# Altium schematic sheet STM32F301C8.SchDoc: STM32F301C7
size A4; Revision: 1.0
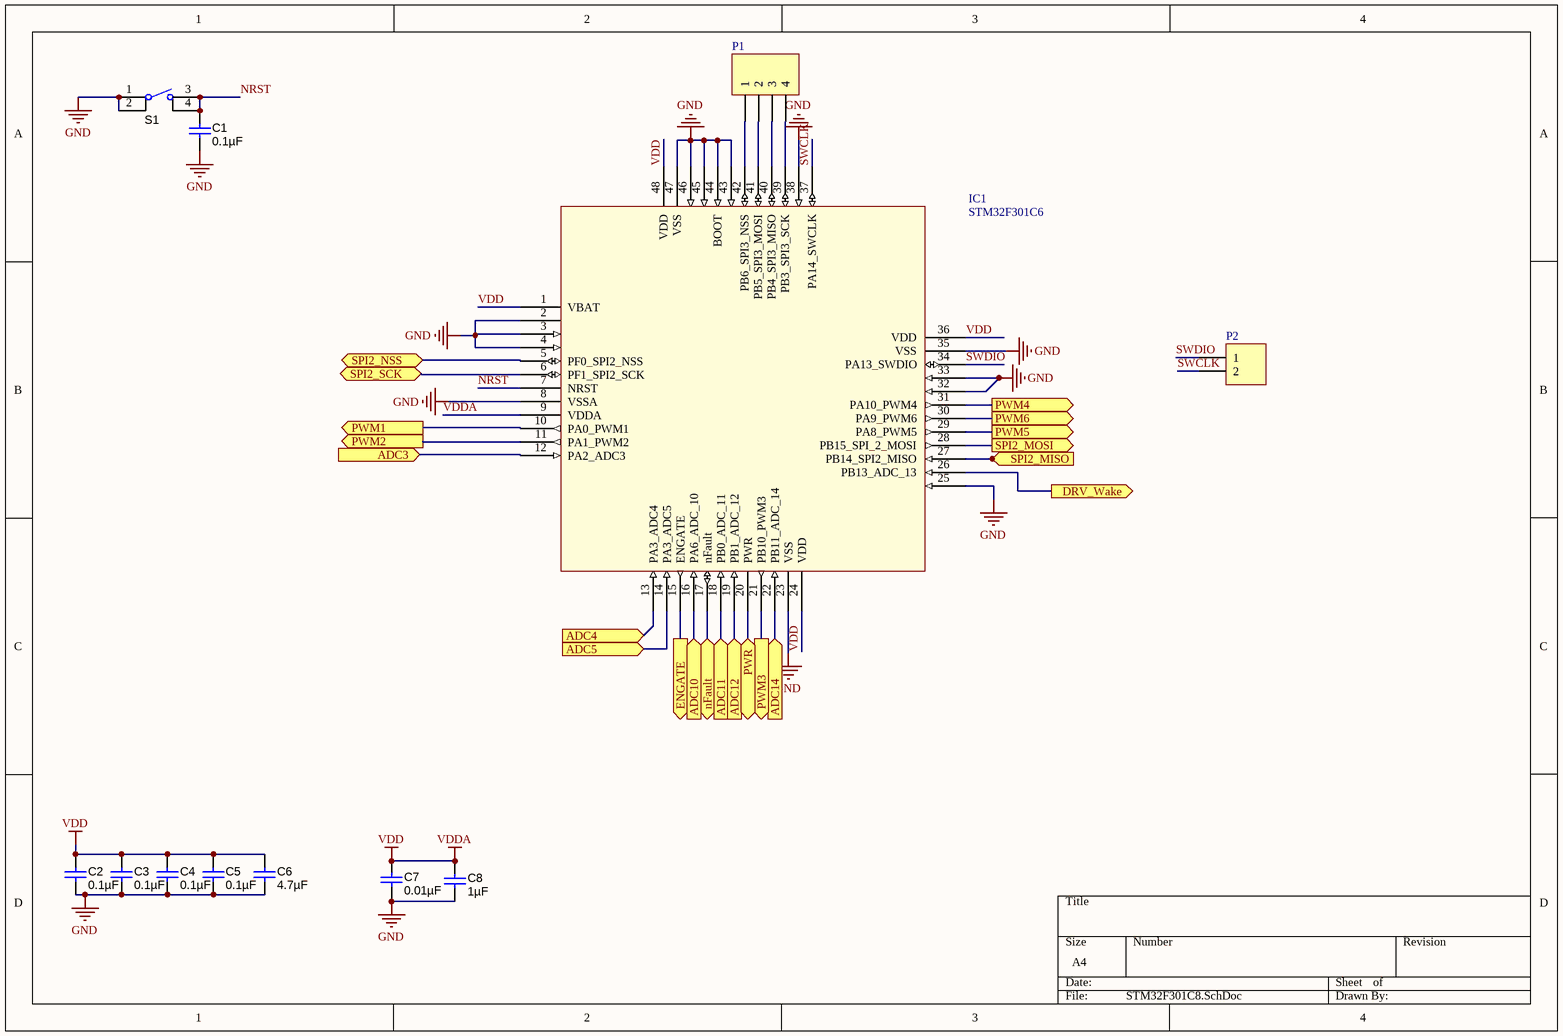
[diagram p0: STM32F301C8.SchDoc]

## Parts
C1  ValueDisplayed: 0.1µF  [0603L]  (hidden comment: C1608X7R1H104K)
C2  ValueDisplayed: 0.1µF  [0603L]  (hidden comment: C1608X7R1H104K)
C3  ValueDisplayed: 0.1µF  [0603L]  (hidden comment: C1608X7R1H104K)
C4  ValueDisplayed: 0.1µF  [0603L]  (hidden comment: C1608X7R1H104K)
C5  ValueDisplayed: 0.1µF  [0603L]  (hidden comment: C1608X7R1H104K)
C6  ValueDisplayed: 4.7µF  [0805L]  (hidden comment: GRM21BR71A475KA73L)
C7  ValueDisplayed: 0.01µF  [0603L]  (hidden comment: C1608X8R1H103K)
C8  ValueDisplayed: 1µF  [0603L]  (hidden comment: C1608X7R1C105K)
IC1  STM32F301C6  [LQFP48-7x7mm]
P1  (no value)  [HDR1X4]
P2  (no value)  [HDR1X2]
S1  4-1437565-1  [SW_FSM4JSMA]  (value not drawn)

## Ports
ADC3 (in), ADC4 (in), ADC5 (in), ADC10 (in), ADC11 (in), ADC12 (in), ADC14 (in), DRV_Wake (out), ENGATE (out), nFault (bidir), PWM1 (out), PWM2 (out), PWM3 (out), PWM4 (out), PWM5 (out), PWM6 (out), PWR, SPI2_MISO (in), SPI2_MOSI (out), SPI2_NSS (bidir), SPI2_SCK (bidir)

## Nets
GND: C1.2 C2.2 C3.2 C4.2 C5.2 C6.2 C7.2 C8.2 IC1.2 IC1.3 IC1.4 IC1.8(VSSA) IC1.23(VSS) IC1.25 IC1.32 IC1.33 IC1.35(VSS) IC1.38 IC1.43 IC1.44(BOOT) IC1.45 IC1.46 IC1.47(VSS) S1.1 S1.2
VDD: C2.1 C3.1 C4.1 C5.1 C6.1 C7.1 C8.1 IC1.1(VBAT) IC1.9(VDDA) IC1.24(VDD) IC1.36(VDD) IC1.48(VDD)  [also labelled VDDA]
ADC3: IC1.12(PA2_ADC3) ; port ADC3
ADC4: IC1.13(PA3_ADC4) ; port ADC4
ADC5: IC1.14(PA3_ADC5) ; port ADC5
ADC10: IC1.16(PA6_ADC_10) ; port ADC10
ADC11: IC1.18(PB0_ADC_11) ; port ADC11
ADC12: IC1.19(PB1_ADC_12) ; port ADC12
ADC14: IC1.22(PB11_ADC_14) ; port ADC14
DRV_Wake: IC1.26(PB13_ADC_13) ; port DRV_Wake
ENGATE: IC1.15(ENGATE) ; port ENGATE
nFault: IC1.17(nFault) ; port nFault
NRST: C1.1 IC1.7(NRST) S1.3 S1.4
PWM1: IC1.10(PA0_PWM1) ; port PWM1
PWM2: IC1.11(PA1_PWM2) ; port PWM2
PWM3: IC1.21(PB10_PWM3) ; port PWM3
PWM4: IC1.31(PA10_PWM4) ; port PWM4
PWM5: IC1.29(PA8_PWM5) ; port PWM5
PWM6: IC1.30(PA9_PWM6) ; port PWM6
PWR: IC1.20(PWR) ; port PWR
SPI2_MISO: IC1.27(PB14_SPI2_MISO) ; port SPI2_MISO
SPI2_MOSI: IC1.28(PB15_SPI_2_MOSI) ; port SPI2_MOSI
SPI2_NSS: IC1.5(PF0_SPI2_NSS) ; port SPI2_NSS
SPI2_SCK: IC1.6(PF1_SPI2_SCK) ; port SPI2_SCK
SWCLK: IC1.37(PA14_SWCLK) P2.2
SWDIO: IC1.34(PA13_SWDIO) P2.1
NetIC1_39: IC1.39(PB3_SPI3_SCK) P1.4
NetIC1_40: IC1.40(PB4_SPI3_MISO) P1.3
NetIC1_41: IC1.41(PB5_SPI3_MOSI) P1.2
NetIC1_42: IC1.42(PB6_SPI3_NSS) P1.1

## Library data of the parts
C1-C5 = C1608X7R1H104K: CAP, CERM, 0.1 µF, 50 V, +/- 10%, X7R, 0603; Manufacturer: TDK; Polarized: N; CompType: Capacitor; Value: 0.1uF; U/M: EA; Cap_F: 0.0000001; Tolerance_%: 10; ESR_ohm: 0.017; Value1: 0.017 ohm; VDC_V: 50; Value2: 50V; TaMin_C: -55; TaMax_C: 125; Cap_Case: 0603; AEC Category: Q200; SymbolVersion: 2008-07-09; PartNumber: C1608X7R1H104K; PackageReference: 0603; RoHS: Y; MountType: SMT; Technology: Ceramic; TempCo: X7R; Published: 2008-06-19; Publisher: Texas Instruments; LatestRevisionDate: 2015-12-04; ComponentLink1Description: Datasheet link; ComponentLink1URL: http://www.tdk.co.jp/tefe02/e412_c.pdf; Supplier 1: Digi-Key; Supplier Part Number 1: 445-1314-1-ND; Supplier 2: Farnell; Supplier Part Number 2: 1118182; AEC Qualified: ?
C6 = GRM21BR71A475KA73L: CAP, CERM, 4.7 µF, 10 V, +/- 10%, X7R, 0805; Manufacturer: MuRata; Polarized: N; CompType: Capacitor; Value: 4.7uF; U/M: EA; Cap_F: 0.0000047; Tolerance_%: 10; Value1: Unknown; Value2: 10V; TaMin_C: -55; TaMax_C: 125; Cap_Case: 0805; AEC Category: Q200; SymbolVersion: 2008-07-09; PartNumber: GRM21BR71A475KA73L; PackageReference: 0805; RoHS: Y; VDC_V: 10; MountType: SMT; Technology: Ceramic; TempCo: X7R; Published: 2008-06-19; Publisher: Texas Instruments; LatestRevisionDate: 2015-12-04; ComponentLink1Description: Datasheet link; ComponentLink1URL: http://search.murata.co.jp/Ceramy/PnsearchViewAction.do?HnOFG=ON&HnNFG=ON&SEL_CNT=50&sLang=en&sKey=GRM21BR71A475KA73L&x=9&y=9&search=startwith; Supplier 1: Digi-Key; Supplier Part Number 1: GRM21BR71A475KA73L-ND; Supplier 2: Mouser; Supplier Part Number 2: 81-GRM21BR71A475KA73; Supplier 3: Farnell; Supplier Part Number 3: 1845769; AEC Qualified: ?
C7 = C1608X8R1H103K: CAP, CERM, 0.01 µF, 50 V, +/- 10%, X8R, 0603; Manufacturer: TDK; Polarized: N; CompType: Capacitor; Value: 0.01uF; U/M: EA; Cap_F: 0.00000001; Tolerance_%: 10; ESR_ohm: 0.051; Value1: 0.051 ohm; VDC_V: 50; Value2: 50V; TaMin_C: -55; TaMax_C: 150; Cap_Case: 0603; AEC Category: Q200; SymbolVersion: 2008-07-09; PartNumber: C1608X8R1H103K; PackageReference: 0603; RoHS: Y; MountType: SMT; Technology: Ceramic; TempCo: X8R; Published: 2008-06-19; Publisher: Texas Instruments; LatestRevisionDate: 2015-12-04; ComponentLink1Description: Datasheet link; ComponentLink1URL: http://www.tdk.com/pdf/X8R.pdf; Supplier 1: Digi-Key; Supplier Part Number 1: 445-2504-1-ND; Supplier 2: Farnell; Supplier Part Number 2: 1844454; AEC Qualified: ?
C8 = C1608X7R1C105K: CAP, CERM, 1 µF, 16 V, +/- 10%, X7R, 0603; Manufacturer: TDK; Polarized: N; CompType: Capacitor; Value: 1uF; U/M: EA; Cap_F: 0.000001; Tolerance_%: 10; ESR_ohm: 0.0057; Value1: 0.0057 ohm; VDC_V: 16; Value2: 16V; TaMin_C: -55; TaMax_C: 125; Cap_Case: 0603; AEC Category: Q200; SymbolVersion: 2008-07-09; PartNumber: C1608X7R1C105K; PackageReference: 0603; RoHS: Y; MountType: SMT; Technology: Ceramic; TempCo: X7R; Published: 2008-06-19; Publisher: Texas Instruments; LatestRevisionDate: 2015-12-04; ComponentLink1Description: Datasheet link; ComponentLink1URL: http://www.tdk.co.jp/tefe02/e412_c.pdf; Supplier 1: Digi-Key; Supplier Part Number 1: 445-1604-1-ND; Supplier 2: Farnell; Supplier Part Number 2: 1907343; AEC Qualified: ?
P1 = Header 4: Header, 4-Pin; LatestRevisionDate: 17-Jul-2002; LatestRevisionNote: Re-released for DXP Platform.; Publisher: Altium Limited
P2 = Header 2: Header, 2-Pin; LatestRevisionDate: 17-Jul-2002; LatestRevisionNote: Re-released for DXP Platform.; Publisher: Altium Limited
S1 = 4-1437565-1: Switch, Tactile, SPST-NO, 0.05A, 12V, SMT; Manufacturer: TE Connectivity; SymbolCreator: a0412235; VDC_V: 12; SwitchFunction: Off-Mom; PositionCount: 1; CurrentRating_mA: 50; SymbolVersion: 2013-06-27; PartNumber: 4-1437565-1; MountType: SMT; ComponentLink1Description: Datasheet URL; ComponentLink1URL: http://www.te.com/commerce/DocumentDelivery/DDEController?Action=showdoc&DocId=Customer+Drawing%7F2-1437565-7%7FU2%7Fpdf%7FEnglish%7FENG_CD_2-1437565-7_U2.pdf%7F4-1437565-1; RoHS: Y; Circuit: SPST-NO; Orientation: Top Actuated; CompType: Switch; PackageReference: SW, SPST 6x6 mm; Publisher: Texas Instruments; LatestRevisionDate: 2015-11-30; Supplier 1: Digi-Key; Supplier Part Number 1: 450-1129-ND; Supplier 2: Mouser; Supplier Part Number 2: 506-FSM4JSMA